# EAGLE design sd_rtc (EAGLE 4.16)
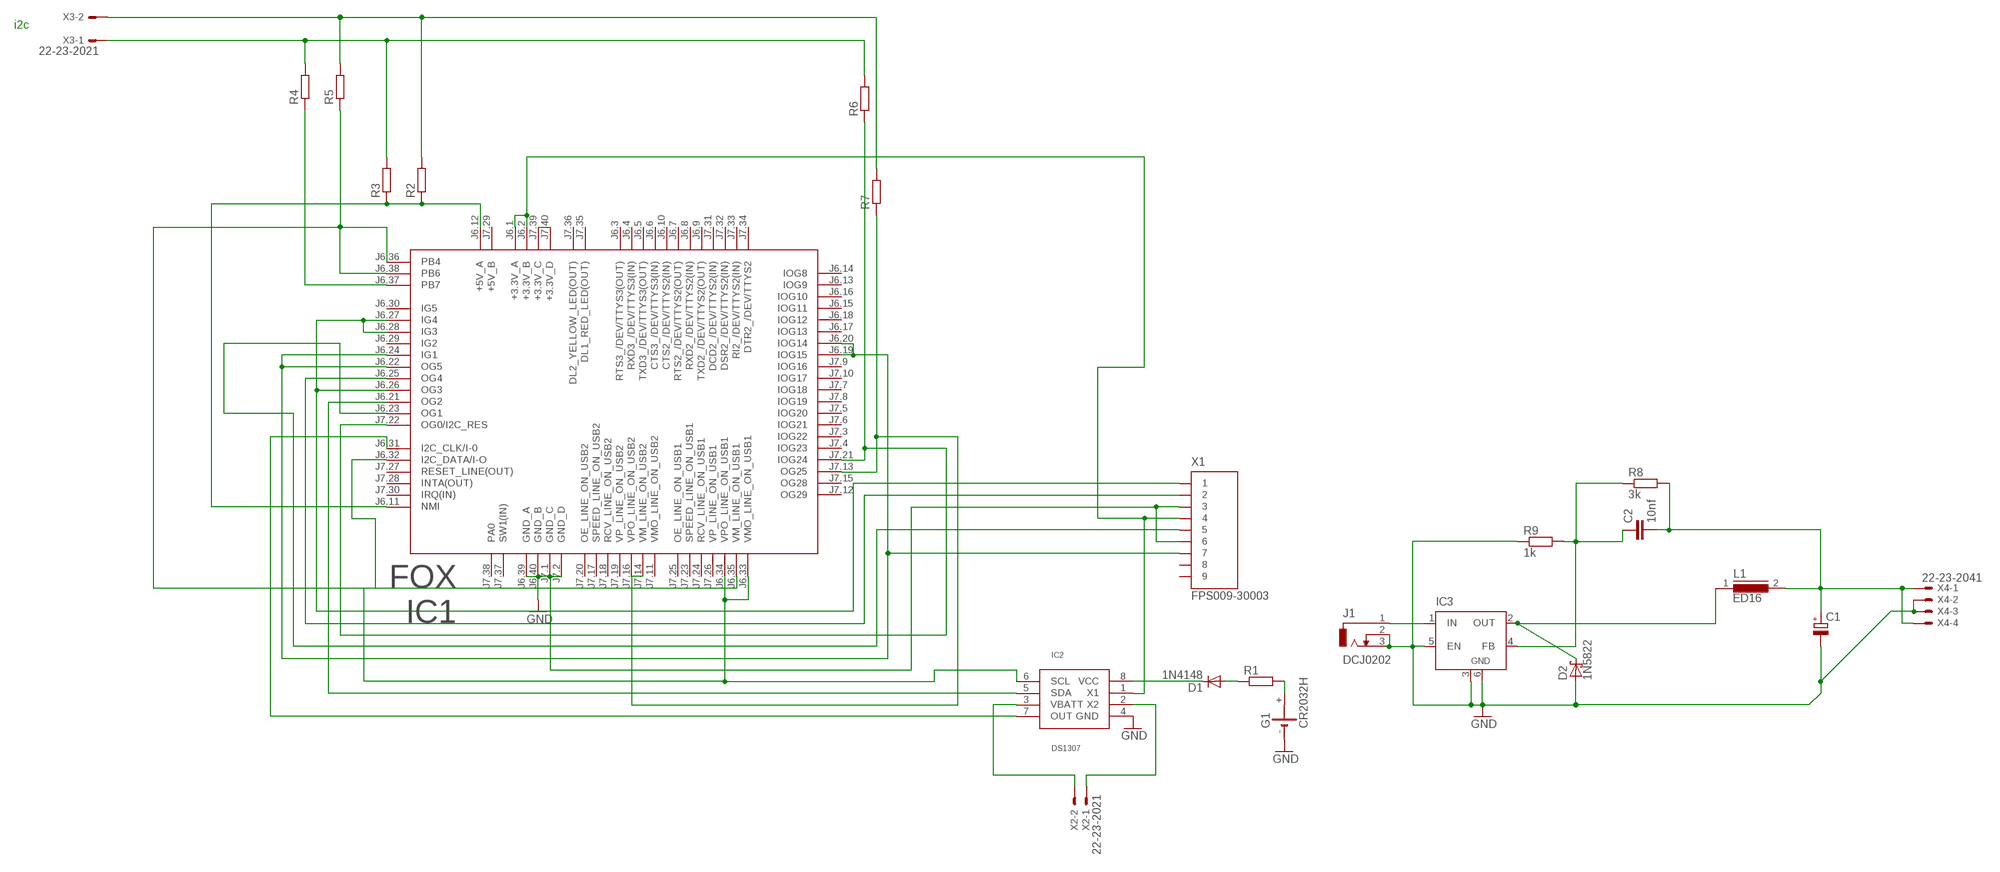
[diagram p0: schematic, sheet 1]

## Parts
C1  CPOL-EUE/7260-38R  [E/7260-38R]
C2  10nf  C-EU025-025X050  [C025-025X050]
D1  1N4148  [DO35-10]
D2  1N5822  1N5908  [C4111-15]
G1  CR2032H  [CR2032H]
IC1  FOX  [FOX]
IC2  DS1307  [DS1307]
IC3  LM2596S  [TO263-5]
J1  DCJ0202  [DCJ0202]
L1  ED16  [ED16]
R1  R-EU_0207/2V  [0207/2V]
R2  R-EU_0207/10  [0207/10]
R3  R-EU_0207/10  [0207/10]
R4  R-EU_M0805  [M0805]
R5  R-EU_M0805  [M0805]
R6  R-EU_M0805  [M0805]
R7  R-EU_M0805  [M0805]
R8  3k  R-EU_0204/2V  [0204V]
R9  1k  R-EU_0204/2V  [0204V]
X1  FPS009-30003  [FPS009-3003]
X2  22-23-2021  [22-23-2021]
X3  22-23-2021  [22-23-2021]
X4  22-23-2041  [22-23-2041]

## Nets
GND: C1.- D2.A G1.- IC1.J6.39(GND_A) IC1.J6.40(GND_B) IC1.J7.1(GND_C) IC1.J7.2(GND_D) IC2.4(GND) IC3.3(GND) IC3.5(EN) IC3.6(GND) J1.2 J1.3 R9.1 X1.3 X1.6 X4.2 X4.3
N$1: IC1.J6.21(OG2) IC2.5(SDA)
N$2: IC1.J6.26(OG3) IC1.J6.27(IG4) IC1.J6.28(IG3) X1.1
N$3: IC1.J6.31(I2C_CLK/I-0) IC2.7(OUT)
N$4: IC1.J6.37(PB7) R4.1
N$5: R2.2 R5.2 R7.2 X3.2
N$6: IC2.3(VBATT) X2.2
N$7: IC2.2(X2) X2.1
N$8: D1.A R1.1
N$9: D1.C IC2.8(VCC)
N$10: G1.+ R1.2
N$11: IC1.J6.25(OG4) X1.2
N$12: IC1.J6.23(OG1) X1.5
N$13: C2.1 IC3.4(FB) R8.1 R9.2
N$14: IC1.J6.19(IOG15) IC1.J6.20(IOG14) IC1.J6.22(OG5) IC1.J6.24(IG1) X1.7
N$15: R3.2 R4.2 R6.2 X3.1
N$16: IC1.J6.11(NMI) IC1.J6.12(+5V_A) R2.1 R3.1
N$17: IC1.J6.1(+3.3V_A) IC1.J6.2(+3.3V_B) IC2.1(X1) X1.4
N$18: IC1.J6.32(I2C_DATA/I-O) IC1.J6.33(VMO_LINE_ON_USB1) IC1.J6.34(VPO_LINE_ON_USB1) IC2.6(SCL)
N$19: IC1.J6.35(VM_LINE_ON_USB1) IC1.J6.36(PB4) IC1.J6.38(PB6) R5.1
N$20: IC1.J7.21(IOG24) IC1.J7.22(OG0/I2C_RES) R6.1
N$21: IC1.J7.13(OG25) IC1.J7.14(VM_LINE_ON_USB2) R7.1
N$23: IC1.J7.39(+3.3V_C) IC1.J7.40(+3.3V_D)
N$24: D2.C IC3.2(OUT) L1.1
N$27: IC3.1(IN) J1.1
N$29: C1.+ C2.2 L1.2 R8.2 X4.1 X4.4
Unconnected: G1.+@1(+) IC1.J6.3(RTS3_/DEV/TTYS3(OUT)) IC1.J6.4(RXD3_/DEV/TTYS3(IN)) IC1.J6.5(TXD3_/DEV/TTYS3(OUT)) IC1.J6.6(CTS3_/DEV/TTYS3(IN)) IC1.J6.7(RTS2_/DEV/TTYS2(OUT)) IC1.J6.8(RXD2_/DEV/TTYS2(IN)) IC1.J6.9(TXD2_/DEV/TTYS2(OUT)) IC1.J6.10(CTS2_/DEV/TTYS2(IN)) IC1.J6.13(IOG9) IC1.J6.14(IOG8) IC1.J6.15(IOG11) IC1.J6.16(IOG10) IC1.J6.17(IOG13) IC1.J6.18(IOG12) IC1.J6.29(IG2) IC1.J6.30(IG5) IC1.J7.3(IOG22) IC1.J7.4(IOG23) IC1.J7.5(IOG20) IC1.J7.6(IOG21) IC1.J7.7(IOG18) IC1.J7.8(IOG19) IC1.J7.9(IOG16) IC1.J7.10(IOG17) IC1.J7.11(VMO_LINE_ON_USB2) IC1.J7.12(OG29) IC1.J7.15(OG28) IC1.J7.16(VPO_LINE_ON_USB2) IC1.J7.17(SPEED_LINE_ON_USB2) IC1.J7.18(RCV_LINE_ON_USB2) IC1.J7.19(VP_LINE_ON_USB2) IC1.J7.20(OE_LINE_ON_USB2) IC1.J7.23(SPEED_LINE_ON_USB1) IC1.J7.24(RCV_LINE_ON_USB1) IC1.J7.25(OE_LINE_ON_USB1) IC1.J7.26(VP_LINE_ON_USB1) IC1.J7.27(RESET_LINE(OUT)) IC1.J7.28(INTA(OUT)) IC1.J7.29(+5V_B) IC1.J7.30(IRQ(IN)) IC1.J7.31(DCD2_/DEV/TTYS2(IN)) IC1.J7.32(DSR2_/DEV/TTYS2(IN)) IC1.J7.33(RI2_/DEV/TTYS2(IN)) IC1.J7.34(DTR2_/DEV/TTYS2) IC1.J7.35(DL1_RED_LED(OUT)) IC1.J7.36(DL2_YELLOW_LED(OUT)) IC1.J7.37(SW1(IN)) IC1.J7.38(PA0) X1.8 X1.9

## Notes on the sheet
- i2c

## Library data of the parts
C1 = rcl:CPOL-EU: POLARIZED CAPACITOR, European symbol
C2 = rcl:C-EU: CAPACITOR, European symbol
D1 = diode:1N4148: DIODE high speed (Philips)
D2 = diode:1N5908: DIODE schottky
G1 = battery:CR2032H: LI BATTERY Varta
IC1 = aggiunte:FOX: FOXBOARD Un sistema linux embedded completo www.acmesystem.it
IC2 = aggiunte:DS1307: DS1307 calendario e orologio I2C
IC3 = linear:LM2596S: STEP-DOWN VOLTAGE REGULATOR
J1 = con-jack:DCJ0202: DC POWER JACK Source: DCJ0202.pdf
L1 = inductors:ED16: INDUCTOR
R1-R9 = rcl:R-EU_: RESISTOR, European symbol
X1 = con-yamaichi:FPS009-30*: SD Card and MMC Reader (Manual Insertion) Source: http://www.yamaichi.de/pdf/c_fps009_3000.pdf
X2 X3 = con-molex:22-23-2021: .100" (2.54mm) Center Header - 2 Pin
X4 = con-molex:22-23-2041: .100" (2.54mm) Center Header - 4 Pin

## Board
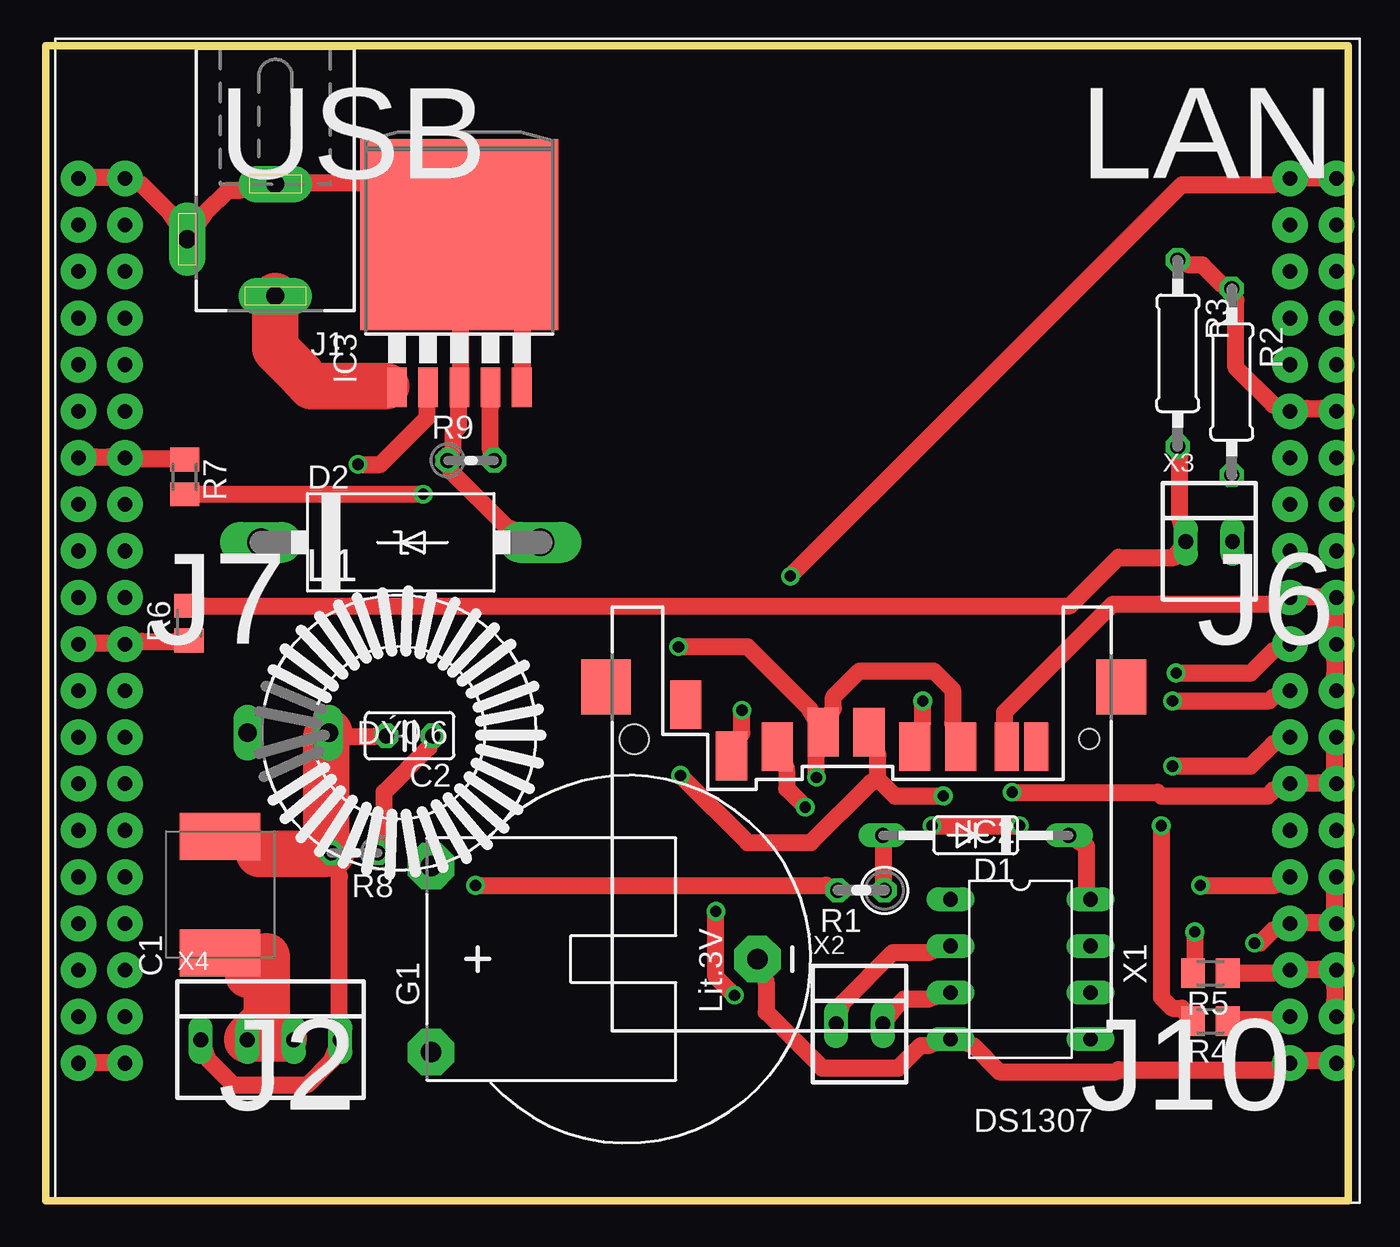
[diagram p1: board, top side]
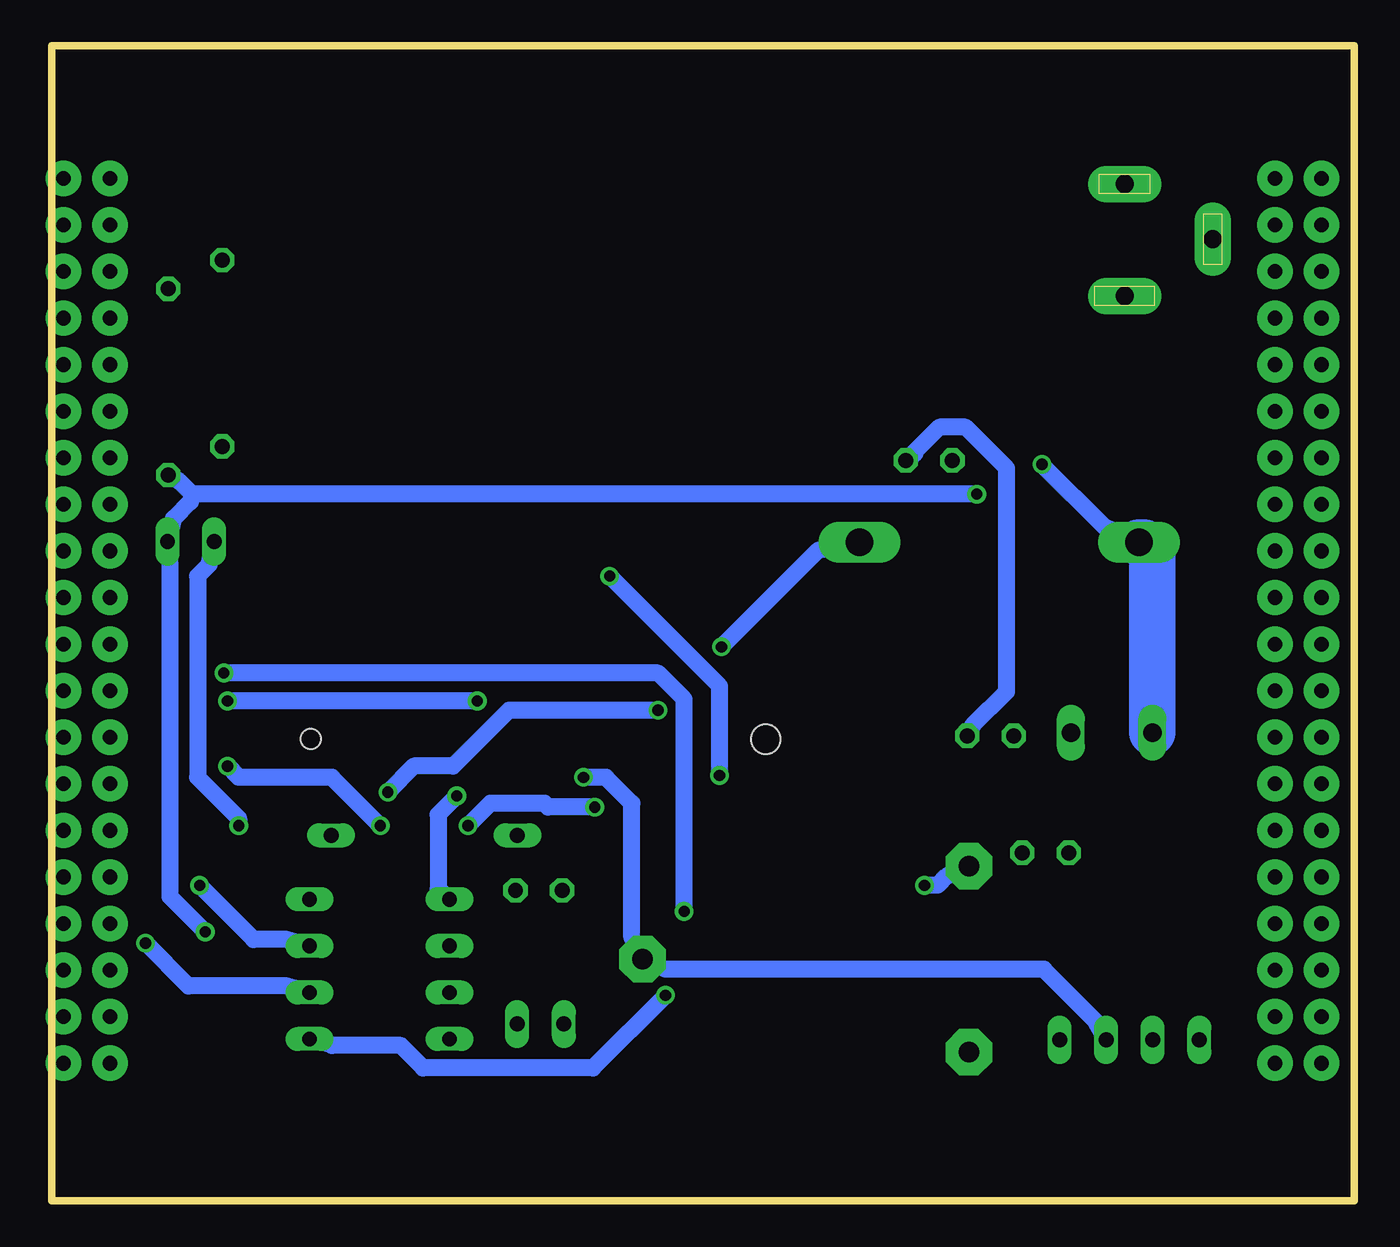
[diagram p2: board, bottom side, seen from below]

Size 71 x 63 mm. Coordinates in mm from the lower left corner, seen from the top.
Outline: 0,63 71,63 71,0 0,0 0,63
Copper layers (1*16): Top 0.035mm / dielectric 1.5mm / Bottom 0.035mm
Design rules "mio": minimum track width 36mil, minimum drill 24mil, track to track 18mil, track to pad 18mil, pad to pad 18mil, via to via 18mil, smd to smd 18mil, copper to edge 0mil, drill to drill 8mil, minimum pad ring 10mil, minimum via ring 8mil, stop-mask expansion 4mil, vias tented up to drill 0mil, thermal gap 10mil

### Footprints (pad centres in the part's own frame; a part is rotated, then mirrored left to right if it is on the bottom)
E/7260-38R = smd 2.55 x 4.4: + 3.175,0; - -3.175,0
C025-025X050 = drill 0.813 octagon: 1 -1.27,0; 2 1.27,0
DO35-10 = drill 0.813 long: A 5.08,0; C -5.08,0
C4111-15 = drill 1.499 long: A 7.62,0; C -7.62,0
CR2032H = drill 1.118 pad 2.54 octagon: + 5.08,10.795; +@1 -5.08,10.795; - 0,-6.985
FOX = drill 0.8 pad 1.93 round: J6.1 67.31,0; J6.2 69.85,0; J6.3 67.31,-2.54; J6.4 69.85,-2.54; J6.5 67.31,-5.08; J6.6 69.85,-5.08; J6.7 67.31,-7.62; J6.8 69.85,-7.62; J6.9 67.31,-10.16; J6.10 69.85,-10.16; J6.11 67.31,-12.7; J6.12 69.85,-12.7; J6.13 67.31,-15.24; J6.14 69.85,-15.24; J6.15 67.31,-17.78; J6.16 69.85,-17.78; J6.17 67.31,-20.32; J6.18 69.85,-20.32; J6.19 67.31,-22.86; J6.20 69.85,-22.86; J6.21 67.31,-25.4; J6.22 69.85,-25.4; J6.23 67.31,-27.94; J6.24 69.85,-27.94; J6.25 67.31,-30.48; J6.26 69.85,-30.48; J6.27 67.31,-33.02; J6.28 69.85,-33.02; J6.29 67.31,-35.56; J6.30 69.85,-35.56; J6.31 67.31,-38.1; J6.32 69.85,-38.1; J6.33 67.31,-40.64; J6.34 69.85,-40.64; J6.35 67.31,-43.18; J6.36 69.85,-43.18; J6.37 67.31,-45.72; J6.38 69.85,-45.72; J6.39 67.31,-48.26; J6.40 69.85,-48.26; J7.1 1.27,0; J7.2 3.81,0; J7.3 1.27,-2.54; J7.4 3.81,-2.54; J7.5 1.27,-5.08; J7.6 3.81,-5.08; J7.7 1.27,-7.62; J7.8 3.81,-7.62; J7.9 1.27,-10.16; J7.10 3.81,-10.16; J7.11 1.27,-12.7; J7.12 3.81,-12.7; J7.13 1.27,-15.24; J7.14 3.81,-15.24; J7.15 1.27,-17.78; J7.16 3.81,-17.78; J7.17 1.27,-20.32; J7.18 3.81,-20.32; J7.19 1.27,-22.86; J7.20 3.81,-22.86; J7.21 1.27,-25.4; J7.22 3.81,-25.4; J7.23 1.27,-27.94; J7.24 3.81,-27.94; J7.25 1.27,-30.48; J7.26 3.81,-30.48; J7.27 1.27,-33.02; J7.28 3.81,-33.02; J7.29 1.27,-35.56; J7.30 3.81,-35.56; J7.31 1.27,-38.1; J7.32 3.81,-38.1; J7.33 1.27,-40.64; J7.34 3.81,-40.64; J7.35 1.27,-43.18; J7.36 3.81,-43.18; J7.37 1.27,-45.72; J7.38 3.81,-45.72; J7.39 1.27,-48.26; J7.40 3.81,-48.26
DS1307 = drill 0.8 long: 1 -8.89,-5.08; 2 -6.35,-5.08; 3 -3.81,-5.08; 4 -1.27,-5.08; 5 -1.27,2.54; 6 -3.81,2.54; 7 -6.35,2.54; 8 -8.89,2.54
TO263-5 = smd 1.067 x 2.159: 1 -3.404,-5.791; 2 -1.702,-5.791; 3 0,-5.791; 4 1.702,-5.791; 5 3.404,-5.791 | smd 10.8 x 10.41: 6 0,2.54
DCJ0202 = drill 1 pad 2 long: 1 0,3.1; 2 4.8,0; 3 0,-3
ED16 = drill 1.016 long: 1 -8.255,0; 2 -3.81,0
0207/2V = drill 0.813 octagon: 1 -1.27,0; 2 1.27,0
0207/10 = drill 0.813 octagon: 1 -5.08,0; 2 5.08,0
M0805 = smd 1.3 x 1.6: 1 -0.95,0; 2 0.95,0
0204V = drill 0.813 octagon: 1 -1.27,0; 2 1.27,0
FPS009-3003 = smd 2.65 x 1.7: 1 -0.915,-5.3; 2 -0.415,-7.8; 3 0.385,-10.3; 4 0.385,-12.8; 5 -0.415,-15.3; 6 -0.415,-17.8; 9 1.885,-2.8 | smd 2.65 x 1.3: 7 -0.415,-20.3; 8 -0.415,-21.925 | smd 3 x 2.7: M1 2.85,1.55; M2 2.85,-26.55 | hole 1.6: 0,0 | hole 1.1: 0,-24.8
22-23-2021 = drill 0.813 long: 1 -1.27,0; 2 1.27,0
22-23-2041 = drill 0.813 long: 1 -3.81,0; 2 -1.27,0; 3 1.27,0; 4 3.81,0

### Placement (x,y rotation side)
C1  9.5,16.71 90 top
C2  19.83,25.37 180 top
D1  50.7,19.94 180 top
D2  19.35,35.92 0 top
G1  31.8,13.19 90 top
IC1  0.51,55.77 0 top
IC2  54.41,7.56 270 top
IC3  22.54,50.16 0 top
J1  12.51,52.46 180 top
L1  19.25,25.54 0 top
R1  44.45,16.94 180 top
R2  64.65,44.67 270 top
R3  61.71,46.23 270 top
R4  63.49,9.81 180 top
R5  63.49,12.43 180 top
R6  7.81,31.51 90 top
R7  7.57,39.49 270 top
R8  16.83,18.99 180 top
R9  23.17,40.39 0 top
X1  32.08,25.19 90 top
X2  44.36,9.65 0 top
X3  63.42,35.97 0 top
X4  12.25,8.79 0 top

### Tracks (layer width: path | path; a pad name or v marks a point on that pad's centre or on a via)
GND  (via drill 0.61)
  Top 0.914: IC1.J6.40 69.55,7.66 68.73,7.66 IC1.J6.39 66.91,7.15 58.47,7.15 58.37,7.05 51.97,7.05 50.55,8.48 IC2.4 48.11,8.48 47.7,8.48 46.48,7.26 42.32,7.26 39.27,10.3 39.27,11.93 G1.- | IC1.J7.1 2.69,55.82 3.41,55.82 IC1.J7.2 5.23,55.41 6.76,53.89 J1.2 8.69,53.89 9.91,55.11 10.52,55.11 J1.3 14.48,55.52 17.22,55.52 IC3.6 | IC3.6 22.61,47.59 22.61,45.36 IC3.3 22.51,43.32 22.51,42.21 22.2,41.9 22.2,40.99 R9.1 22.1,39.77 25.15,36.72 D2.A | IC3.5 25.96,45.36 25.96,47.59 IC3.6 | X4.2 11.64,8.88 | 12.96,8.88 X4.3 | 11.03,12.34 C1.- | X1.6 49.43,26.05 49.43,27.88 48.41,28.9 44.35,28.9 42.93,27.47 42.93,26.87 X1.3 | v42.01,23.11 42.01,24.33 X1.3 | v34.49,30.22 38.25,30.22 41.61,26.87 X1.3
  Top 2.54: 11.03,12.34 12.04,13.35 12.04,9.9 11.33,9.19 | X4.2 10.98,8.84 11.33,9.19 | 12.96,8.88 11.64,8.88 11.33,9.19
  Bottom 0.914: v42.01,23.11 40.79,23.11 39.37,21.68 39.37,14.37 G1.- 37.54,12.64 16.92,12.64 14.07,9.8 X4.3 | v34.49,30.22 29.21,35.5 D2.A
N$1  (via drill 0.61)
  Top 0.914: v37.54,11.22 36.53,12.23 v36.53,15.79 | v61.62,28.8 65.69,28.8 66.91,30.01 IC1.J6.21
  Bottom 0.914: v37.54,11.22 41.51,7.26 50.75,7.26 51.97,8.48 55.73,8.48 IC2.5 | v36.53,15.79 36.53,27.37 37.95,28.8 v61.62,28.8
N$2  (via drill 0.61)
  Top 0.914: v37.95,26.76 37.95,25.54 X1.1 | v52.68,22.29 60.61,22.29 60.81,22.09 66.6,22.09 66.91,22.39 IC1.J6.27 68.73,22.8 69.45,22.8 IC1.J6.28 70.26,23.61 70.26,24.43 IC1.J6.26
  Bottom 0.914: v37.95,26.76 46.08,26.76 49.13,23.72 51.26,23.72 v52.68,22.29
N$3  (via drill 0.61)
  Top 0.914: v62.94,17.21 67.01,17.21 IC1.J6.31
  Bottom 0.914: v62.94,17.21 60,14.27 58.17,14.27 IC2.7
N$4
  Top 0.914: R4.1 65.08,9.9 66.91,9.9 IC1.J6.37
N$5  (via drill 0.61)
  Top 0.914: v62.64,14.67 62.64,13.15 R5.2 | v20.58,38.55 8.28,38.55 R7.2
  Bottom 0.914: v62.64,14.67 64.57,16.6 64.57,34.69 X3.2 64.37,37.23 63.45,38.14 63.35,38.55 | v20.58,38.55 63.35,38.55 | 63.35,38.55 64.06,39.26 R2.2
N$6
  Top 0.914: IC2.3 48.11,11.02 46.79,11.02 46.28,10.51 X2.2
N$7
  Top 0.914: IC2.2 48.11,13.55 46.18,13.55 43.44,10.81 X2.1
N$8
  Top 0.914: R1.1 45.67,17.52 45.67,19.35 D1.A
N$9
  Top 0.914: IC2.8 56.75,17.01 56.75,19.35 D1.C
N$10  (via drill 0.61)
  Top 0.914: v23.42,17.21 42.52,17.21 R1.2
  Bottom 0.914: v23.42,17.21 22.71,17.21 22.2,17.72 G1.+
N$11  (via drill 0.61)
  Top 0.914: v41.4,21.48 40.39,22.5 40.39,23.51 X1.2 | v48.31,20.46 v53.09,20.46 | v61.42,23.72 65.69,23.72 66.91,24.93 IC1.J6.25
  Bottom 0.914: v41.4,21.48 43.94,21.48 44.15,21.68 47.09,21.68 v48.31,20.46 | v53.09,20.46 55.73,23.11 60.81,23.11 v61.42,23.72
N$12  (via drill 0.61)
  Top 0.914: v47.8,27.27 47.8,26.05 X1.5 | v61.42,27.27 66.7,27.27 66.91,27.47 IC1.J6.23
  Bottom 0.914: v47.8,27.27 v61.42,27.27
N$13
  Top 0.914: IC3.4 24.23,43.32 24.23,40.99 R9.2 | R8.1 18.44,19.55 18.44,22.29 20.88,24.73 C2.1
  Bottom 0.914: R9.2 23.93,40.78 23.93,40.89 22.61,42.21 21.19,42.21 18.95,39.97 18.95,27.78 20.78,25.95 C2.1
N$14
  Top 0.914: X1.7 52.28,26.05 52.28,26.66 58.17,32.55 66.91,32.55 IC1.J6.19 68.73,32.96 69.45,32.96 IC1.J6.20 70.26,32.05 70.26,31.23 IC1.J6.22 70.26,29.51 70.26,28.69 IC1.J6.24
N$15  (via drill 0.61)
  Top 0.914: R6.2 8.59,32.45 55.83,32.45 58.47,35.09 61.52,35.09 X3.1 61.83,37.23 61.83,40.58 R3.2 | v60.81,20.46 60.81,11.12 61.42,10.51 61.93,10.51 R4.2
  Bottom 0.914: v60.81,20.46 60.81,20.87 63.05,23.11 63.05,34.08 62.44,34.69 X3.1
N$16
  Top 0.914: IC1.J6.12 69.55,43.22 68.73,43.22 IC1.J6.11 66.91,43.43 64.87,45.46 64.87,49.12 R2.1 64.06,50.03 63.05,51.05 62.33,51.05 R3.1
N$17  (via drill 0.61)
  Top 0.914: IC1.J6.2 69.55,55.82 68.73,55.82 IC1.J6.1 66.91,55.41 61.93,55.41 v40.59,34.08 | v48.92,22.09 46.28,22.09 45.37,23 | 45.37,23 45.37,24.33 X1.4 | v34.6,23.21 38.25,19.55 41.71,19.55 44.96,22.8 45.37,23
  Bottom 0.914: v48.92,22.09 49.94,21.07 49.94,17.01 IC2.1 | v40.59,34.08 34.6,28.08 v34.6,23.21
N$18  (via drill 0.61)
  Top 0.914: v65.89,14.06 66.19,14.06 66.91,14.77 IC1.J6.33 68.73,15.18 69.45,15.18 IC1.J6.34 70.26,15.99 70.26,16.81 IC1.J6.32
  Bottom 0.914: v65.89,14.06 63.55,11.73 58.17,11.73 IC2.6
N$19
  Top 0.914: R5.1 65.08,12.44 66.91,12.44 IC1.J6.35 68.73,12.64 69.45,12.64 IC1.J6.36 70.26,11.73 70.26,10.91 IC1.J6.38
N$20
  Top 0.914: R6.1 7.06,30.52 5.23,30.52 IC1.J7.22 3.41,30.42 2.69,30.42 IC1.J7.21
N$21
  Top 0.914: R7.1 6.86,40.48 5.23,40.48 IC1.J7.14 3.41,40.58 2.69,40.58 IC1.J7.13
N$23
  Top 0.914: IC1.J7.39 2.69,7.56 3.41,7.56 IC1.J7.40
N$24  (via drill 0.61)
  Top 0.914: v17.02,40.17 18.24,40.17 20.78,42.71 20.78,43.32 IC3.2
  Bottom 0.914: v17.02,40.17 13.57,36.72 D2.C 11.03,34.89
  Bottom 2.54: D2.C 11.45,35.92 11,35.47 L1.1
N$27
  Top 0.914: IC3.1 19.15,44.44 18.34,44.44
  Top 2.54: J1.1 12.51,46.49 14,45 14,44.92 14.48,44.44 18.34,44.44 18.54,44.44
N$29
  Top 0.914: X4.1 8.89,7.66 10.21,6.34 14.28,6.34 15.6,7.66 X4.4 16,10.1 16,17.72 R8.2 14.99,18.94 | C2.2 17.93,25.34 16.11,25.34 L1.2 | 11.64,18.94 C1.+
  Top 2.54: 15.29,19.04 15.34,18.99 R8.2 | 11.64,18.94 15.19,18.94 15.29,19.04 | L1.2 15.44,25.49 15.29,25.34 15.29,19.04